# Altium project ZOOM_Camera_drive.PrjPcb
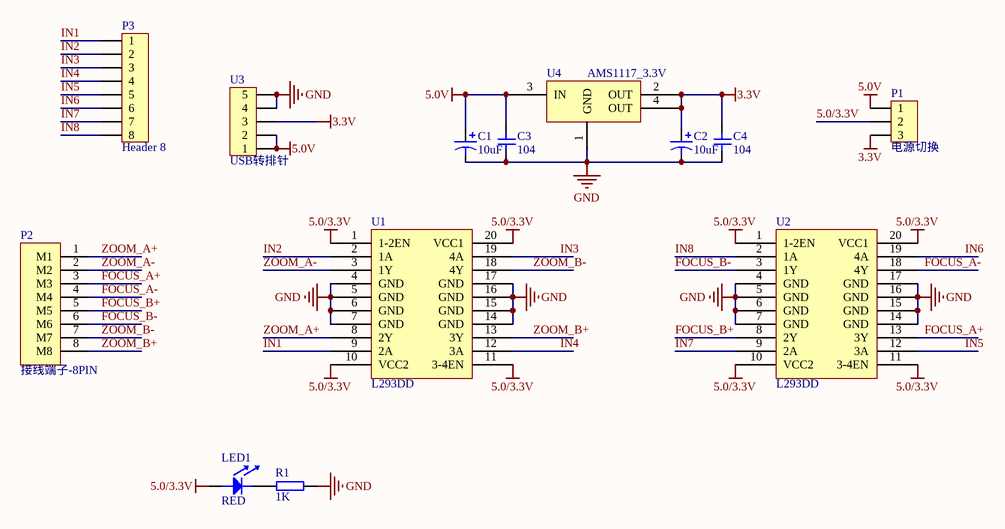
[diagram p0: Zoom_camera.SchDoc]
1 sheet, 13 parts. Net scope: global (net labels, ports and power ports of the same name join across sheets).
Board file: Zoom_camera.PcbDoc

## Sheet Zoom_camera.SchDoc
size A3

### Parts
C1  10uF  [TAJ-B]
C2  10uF  [TAJ-B]
C3  104  [0805C]
C4  104  [0805C]
LED1  RED  [0805LED]
P1  电源切换  [Header 3]
P2  接线端子-8PIN  [MX1.25MM-8P]
P3  Header 8  [Header 8]
R1  1K  [0805R]
U1  L293DD  [SOP-20M]
U2  L293DD  [SOP-20M]
U3  USB转排针  [USB转排针]
U4  AMS1117_3.3V  [SOT-223]

### Nets
3.3V: C2.1 C4.2 P1.3 U3.3 U4.2(OUT) U4.4(OUT)
5.0/3.3V: LED1.1 P1.2 U1.1(1-2EN) U1.10(VCC2) U1.11(3-4EN) U1.20(VCC1) U2.1(1-2EN) U2.10(VCC2) U2.11(3-4EN) U2.20(VCC1)
5.0V: C1.1 C3.2 P1.1 U3.1 U3.2 U4.3(IN)
GND: C1.2 C2.2 C3.1 C4.1 R1.2 U1.4(GND) U1.5(GND) U1.6(GND) U1.7(GND) U1.14(GND) U1.15(GND) U1.16(GND) U1.17(GND) U2.4(GND) U2.5(GND) U2.6(GND) U2.7(GND) U2.14(GND) U2.15(GND) U2.16(GND) U2.17(GND) U3.4 U3.5 U4.1(GND)
FOCUS_A+: P2.3(M3) U2.13(3Y)
FOCUS_A-: P2.4(M4) U2.18(4Y)
FOCUS_B+: P2.5(M5) U2.8(2Y)
FOCUS_B-: P2.6(M6) U2.3(1Y)
IN1: P3.1 U1.9(2A)
IN2: P3.2 U1.2(1A)
IN3: P3.3 U1.19(4A)
IN4: P3.4 U1.12(3A)
IN5: P3.5 U2.12(3A)
IN6: P3.6 U2.19(4A)
IN7: P3.7 U2.9(2A)
IN8: P3.8 U2.2(1A)
ZOOM_A+: P2.1(M1) U1.8(2Y)
ZOOM_A-: P2.2(M2) U1.3(1Y)
ZOOM_B+: P2.8(M8) U1.13(3Y)
ZOOM_B-: P2.7(M7) U1.18(4Y)
NetLED1_2: LED1.2 R1.1

### Library data of the parts
C1 C2 = Pol Cap: 极性贴片电容
C3 C4 = Cap1: 无极贴片电容
LED1 = LED: 发光二极管
P1 = Header 3: 排针
P3 = Header 8: 排针
R1 = Res: 电阻
U1 U2 = L293D
U4 = AMS1117-3.3V/5.0V: 电源芯片